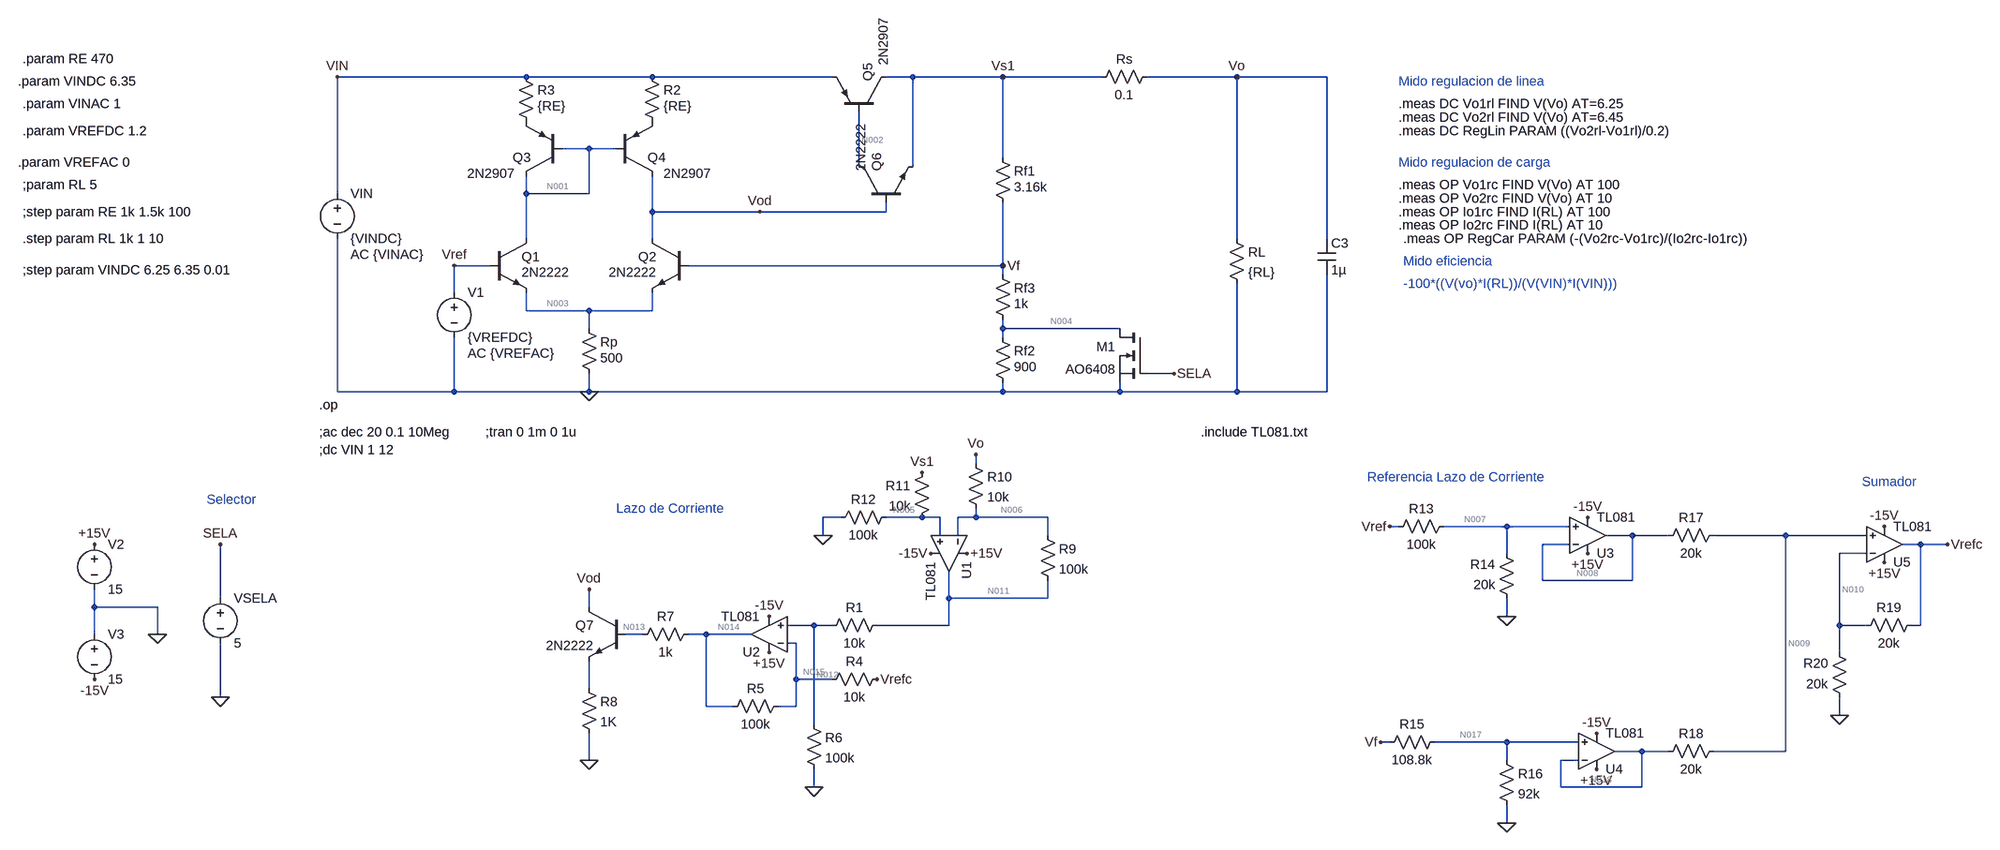
[diagram p0: schematic Regulador_LDOA_v2_Cuasi_Darlington_selector_prueba.asc]
Regulador_LDOA_v2_Cuasi_Darlington_selector_prueba.asc, the LTspice schematic file:
Version 4
SHEET 1 2316 856
WIRE -8688 -2384 -9024 -2384
WIRE -8464 -2384 -8688 -2384
WIRE -8144 -2384 -8464 -2384
WIRE -8000 -2384 -8048 -2384
WIRE -7840 -2384 -8000 -2384
WIRE -7664 -2384 -7840 -2384
WIRE -7424 -2384 -7584 -2384
WIRE -7264 -2384 -7424 -2384
WIRE -8576 -2256 -8624 -2256
WIRE -8528 -2256 -8576 -2256
WIRE -7840 -2240 -7840 -2384
WIRE -8096 -2224 -8096 -2320
WIRE -8000 -2224 -8000 -2384
WIRE -9024 -2176 -9024 -2384
WIRE -8688 -2176 -8688 -2208
WIRE -8576 -2176 -8576 -2256
WIRE -8576 -2176 -8688 -2176
WIRE -8464 -2144 -8464 -2208
WIRE -8272 -2144 -8464 -2144
WIRE -8048 -2144 -8048 -2160
WIRE -8048 -2144 -8272 -2144
WIRE -8688 -2096 -8688 -2176
WIRE -8464 -2096 -8464 -2144
WIRE -7424 -2096 -7424 -2384
WIRE -7264 -2096 -7264 -2384
WIRE -8752 -2048 -8816 -2048
WIRE -7840 -2048 -7840 -2160
WIRE -7840 -2048 -8400 -2048
WIRE -7840 -2032 -7840 -2048
WIRE -8816 -2000 -8816 -2048
WIRE -8688 -1968 -8688 -2000
WIRE -8576 -1968 -8688 -1968
WIRE -8464 -1968 -8464 -2000
WIRE -8464 -1968 -8576 -1968
WIRE -8576 -1936 -8576 -1968
WIRE -7840 -1936 -7840 -1952
WIRE -7632 -1936 -7840 -1936
WIRE -7840 -1920 -7840 -1936
WIRE -7536 -1856 -7584 -1856
WIRE -9024 -1824 -9024 -2096
WIRE -8816 -1824 -8816 -1920
WIRE -8816 -1824 -9024 -1824
WIRE -8576 -1824 -8576 -1856
WIRE -8576 -1824 -8816 -1824
WIRE -7840 -1824 -7840 -1840
WIRE -7840 -1824 -8576 -1824
WIRE -7632 -1824 -7632 -1840
WIRE -7632 -1824 -7840 -1824
WIRE -7424 -1824 -7424 -2016
WIRE -7424 -1824 -7632 -1824
WIRE -7264 -1824 -7264 -2032
WIRE -7264 -1824 -7424 -1824
WIRE -7888 -1696 -7888 -1712
WIRE -8128 -1600 -8160 -1600
WIRE -7984 -1600 -8048 -1600
WIRE -7952 -1600 -7984 -1600
WIRE -7888 -1600 -7888 -1616
WIRE -7888 -1600 -7920 -1600
WIRE -7760 -1600 -7888 -1600
WIRE -7136 -1584 -7152 -1584
WIRE -6944 -1584 -7056 -1584
WIRE -6832 -1584 -6944 -1584
WIRE -8160 -1568 -8160 -1600
WIRE -7952 -1568 -7952 -1600
WIRE -7920 -1568 -7920 -1600
WIRE -7760 -1568 -7760 -1600
WIRE -6720 -1568 -6768 -1568
WIRE -6656 -1568 -6720 -1568
WIRE -6448 -1568 -6576 -1568
WIRE -6304 -1568 -6448 -1568
WIRE -6832 -1552 -6880 -1552
WIRE -6208 -1552 -6240 -1552
WIRE -6160 -1552 -6208 -1552
WIRE -6944 -1536 -6944 -1584
WIRE -6304 -1536 -6352 -1536
WIRE -6880 -1488 -6880 -1552
WIRE -6720 -1488 -6720 -1568
WIRE -6720 -1488 -6880 -1488
WIRE -9232 -1456 -9232 -1552
WIRE -7936 -1456 -7936 -1504
WIRE -7760 -1456 -7760 -1488
WIRE -7760 -1456 -7936 -1456
WIRE -9456 -1440 -9456 -1472
WIRE -9344 -1440 -9456 -1440
WIRE -8576 -1440 -8576 -1472
WIRE -6944 -1424 -6944 -1456
WIRE -8176 -1408 -8224 -1408
WIRE -8144 -1408 -8176 -1408
WIRE -7936 -1408 -7936 -1456
WIRE -7936 -1408 -8064 -1408
WIRE -6352 -1408 -6352 -1536
WIRE -6304 -1408 -6352 -1408
WIRE -6208 -1408 -6208 -1552
WIRE -6208 -1408 -6224 -1408
WIRE -9456 -1392 -9456 -1440
WIRE -9344 -1392 -9344 -1440
WIRE -8480 -1392 -8512 -1392
WIRE -8368 -1392 -8400 -1392
WIRE -8288 -1392 -8368 -1392
WIRE -8208 -1376 -8224 -1376
WIRE -6352 -1360 -6352 -1408
WIRE -8208 -1312 -8208 -1376
WIRE -8144 -1312 -8208 -1312
WIRE -8576 -1296 -8576 -1344
WIRE -9232 -1280 -9232 -1376
WIRE -8368 -1264 -8368 -1392
WIRE -8320 -1264 -8368 -1264
WIRE -8208 -1264 -8208 -1312
WIRE -8208 -1264 -8240 -1264
WIRE -6352 -1248 -6352 -1280
WIRE -8176 -1232 -8176 -1408
WIRE -7152 -1200 -7168 -1200
WIRE -6944 -1200 -7072 -1200
WIRE -6816 -1200 -6944 -1200
WIRE -6704 -1184 -6752 -1184
WIRE -6656 -1184 -6704 -1184
WIRE -6448 -1184 -6448 -1568
WIRE -6448 -1184 -6576 -1184
WIRE -8576 -1168 -8576 -1216
WIRE -6944 -1168 -6944 -1200
WIRE -6816 -1168 -6848 -1168
WIRE -8176 -1120 -8176 -1152
WIRE -6848 -1120 -6848 -1168
WIRE -6704 -1120 -6704 -1184
WIRE -6704 -1120 -6848 -1120
WIRE -6944 -1056 -6944 -1088
FLAG -8576 -1824 0
FLAG -7424 -2384 Vo
FLAG -8816 -2048 Vref
FLAG -9024 -2384 VIN
FLAG -7840 -2048 Vf
FLAG -7840 -2384 Vs1
FLAG -8176 -1120 0
FLAG -8272 -2144 Vod
FLAG -8576 -1168 0
FLAG -8576 -1472 Vod
FLAG -8064 -1312 Vrefc
FLAG -7984 -1680 Vs1
FLAG -7888 -1712 Vo
FLAG -7968 -1536 -15V
FLAG -8256 -1424 -15V
FLAG -7904 -1536 +15V
FLAG -8256 -1360 +15V
FLAG -9344 -1392 0
FLAG -9456 -1552 +15V
FLAG -9456 -1312 -15V
FLAG -8160 -1568 0
FLAG -6352 -1248 0
FLAG -6944 -1056 0
FLAG -6944 -1424 0
FLAG -6160 -1552 Vrefc
FLAG -7168 -1200 Vf
FLAG -7152 -1584 Vref
FLAG -6800 -1536 +15V
FLAG -6272 -1520 +15V
FLAG -6784 -1152 +15V
FLAG -6800 -1600 -15V
FLAG -6784 -1216 -15V
FLAG -6272 -1584 -15V
FLAG -7536 -1856 SELA
FLAG -9232 -1552 SELA
FLAG -9232 -1280 0
DATAFLAG -7584 -2384 ""
DATAFLAG -8160 -2048 ""
SYMBOL pnp -8624 -2208 R180
WINDOW 3 84 4 Left 2
SYMATTR Value 2N2907
SYMATTR InstName Q3
SYMBOL pnp -8528 -2208 M180
WINDOW 3 84 4 Left 2
SYMATTR Value 2N2907
SYMATTR InstName Q4
SYMBOL npn -8752 -2096 R0
WINDOW 3 56 60 Left 2
SYMATTR Value 2N2222
SYMATTR InstName Q1
SYMBOL npn -8400 -2096 M0
WINDOW 3 56 60 Left 2
SYMATTR Value 2N2222
SYMATTR InstName Q2
SYMBOL res -8592 -1952 R0
WINDOW 3 36 68 Left 2
SYMATTR Value 500
SYMATTR InstName Rp
SYMBOL pnp -8048 -2320 M270
WINDOW 3 84 4 Left 2
SYMATTR Value 2N2907
SYMATTR InstName Q5
SYMBOL npn -8096 -2160 R270
WINDOW 3 56 4 Left 2
SYMATTR Value 2N2222
SYMATTR InstName Q6
SYMBOL res -7856 -2256 R0
WINDOW 3 36 68 Left 2
SYMATTR Value 3.16k
SYMATTR InstName Rf1
SYMBOL res -7856 -1936 R0
WINDOW 3 36 68 Left 2
SYMATTR Value 900
SYMATTR InstName Rf2
SYMBOL res -7440 -2112 R0
SYMATTR InstName RL
SYMATTR Value {RL}
SYMBOL voltage -8816 -2016 R0
WINDOW 123 24 124 Left 2
WINDOW 39 0 0 Left 0
SYMATTR Value2 AC {VREFAC}
SYMATTR InstName V1
SYMATTR Value {VREFDC}
SYMBOL voltage -9024 -2192 R0
WINDOW 123 24 124 Left 2
WINDOW 39 0 0 Left 0
SYMATTR Value2 AC {VINAC}
SYMATTR InstName VIN
SYMATTR Value {VINDC}
SYMBOL res -8704 -2400 R0
WINDOW 3 36 68 Left 2
SYMATTR Value {RE}
SYMATTR InstName R3
SYMBOL res -8480 -2400 R0
WINDOW 3 36 68 Left 2
SYMATTR Value {RE}
SYMATTR InstName R2
SYMBOL cap -7280 -2096 R0
SYMATTR InstName C3
SYMATTR Value 1µ
SYMBOL res -7568 -2400 R90
WINDOW 0 0 56 VBottom 2
WINDOW 3 32 56 VTop 2
SYMATTR InstName Rs
SYMATTR Value 0.1
SYMBOL OpAmps\\opamp2 -7872 -1536 R90
SYMATTR InstName U1
SYMATTR Value TL081
SYMBOL OpAmps\\opamp2 -8256 -1328 R180
SYMATTR InstName U2
SYMATTR Value TL081
SYMBOL res -8048 -1424 R90
WINDOW 0 0 56 VBottom 2
WINDOW 3 32 56 VTop 2
SYMATTR InstName R1
SYMATTR Value 10k
SYMBOL res -8048 -1328 R90
WINDOW 0 0 56 VBottom 2
WINDOW 3 32 56 VTop 2
SYMATTR InstName R4
SYMATTR Value 10k
SYMBOL res -8224 -1280 R90
WINDOW 0 0 56 VBottom 2
WINDOW 3 32 56 VTop 2
SYMATTR InstName R5
SYMATTR Value 100k
SYMBOL res -8192 -1248 R0
SYMATTR InstName R6
SYMATTR Value 100k
SYMBOL npn -8512 -1440 M0
SYMATTR InstName Q7
SYMATTR Value 2N2222
SYMBOL res -8592 -1312 R0
SYMATTR InstName R8
SYMATTR Value 1K
SYMBOL voltage -9456 -1568 R0
SYMATTR InstName V2
SYMATTR Value 15
SYMBOL voltage -9456 -1408 R0
SYMATTR InstName V3
SYMATTR Value 15
SYMBOL res -7776 -1584 R0
SYMATTR InstName R9
SYMATTR Value 100k
SYMBOL res -7904 -1712 R0
SYMATTR InstName R10
SYMATTR Value 10k
SYMBOL res -7968 -1696 M0
SYMATTR InstName R11
SYMATTR Value 10k
SYMBOL res -8032 -1616 R90
WINDOW 0 0 56 VBottom 2
WINDOW 3 32 56 VTop 2
SYMATTR InstName R12
SYMATTR Value 100k
SYMBOL res -8384 -1408 R90
WINDOW 0 0 56 VBottom 2
WINDOW 3 32 56 VTop 2
SYMATTR InstName R7
SYMATTR Value 1k
SYMBOL res -7040 -1600 R90
WINDOW 0 0 56 VBottom 2
WINDOW 3 32 56 VTop 2
SYMATTR InstName R13
SYMATTR Value 100k
SYMBOL res -6928 -1440 R180
WINDOW 0 36 76 Left 2
WINDOW 3 36 40 Left 2
SYMATTR InstName R14
SYMATTR Value 20k
SYMBOL res -7168 -1184 R270
WINDOW 0 32 56 VTop 2
WINDOW 3 0 56 VBottom 2
SYMATTR InstName R15
SYMATTR Value 108.8k
SYMBOL res -6960 -1184 R0
SYMATTR InstName R16
SYMATTR Value 92k
SYMBOL res -6560 -1584 R90
WINDOW 0 0 56 VBottom 2
WINDOW 3 32 56 VTop 2
SYMATTR InstName R17
SYMATTR Value 20k
SYMBOL res -6560 -1200 R90
WINDOW 0 0 56 VBottom 2
WINDOW 3 32 56 VTop 2
SYMATTR InstName R18
SYMATTR Value 20k
SYMBOL res -6208 -1424 R90
WINDOW 0 0 56 VBottom 2
WINDOW 3 32 56 VTop 2
SYMATTR InstName R19
SYMATTR Value 20k
SYMBOL res -6336 -1264 R180
WINDOW 0 36 76 Left 2
WINDOW 3 36 40 Left 2
SYMATTR InstName R20
SYMATTR Value 20k
SYMBOL OpAmps\\opamp2 -6800 -1504 M180
SYMATTR InstName U3
SYMATTR Value TL081
SYMBOL OpAmps\\opamp2 -6784 -1120 M180
SYMATTR InstName U4
SYMATTR Value TL081
SYMBOL OpAmps\\opamp2 -6272 -1488 M180
SYMATTR InstName U5
SYMATTR Value TL081
SYMBOL res -7856 -2048 R0
WINDOW 3 36 68 Left 2
SYMATTR Value 1k
SYMATTR InstName Rf3
SYMBOL nmos -7584 -1936 M0
SYMATTR InstName M1
SYMATTR Value AO6408
SYMBOL voltage -9232 -1472 R0
WINDOW 123 0 0 Left 0
WINDOW 39 0 0 Left 0
SYMATTR InstName VSELA
SYMATTR Value 5
TEXT -9056 -1800 Left 2 !.op
TEXT -9056 -1752 Left 2 !;ac dec 20 0.1 10Meg
TEXT -9592 -2376 Left 2 !.param VINDC 6.35
TEXT -9584 -2336 Left 2 !.param VINAC 1
TEXT -9584 -2288 Left 2 !.param VREFDC 1.2
TEXT -9592 -2232 Left 2 !.param VREFAC 0
TEXT -9584 -2192 Left 2 !;param RL 5
TEXT -9056 -1720 Left 2 !;dc VIN 1 12
TEXT -9584 -2144 Left 2 !;step param RE 1k 1.5k 100
TEXT -9584 -2416 Left 2 !.param RE 470
TEXT -9584 -2096 Left 2 !.step param RL 1k 1 10
TEXT -7136 -2376 Left 2 ;Mido regulacion de linea
TEXT -7136 -2336 Left 2 !.meas DC Vo1rl FIND V(Vo) AT=6.25
TEXT -7136 -2312 Left 2 !.meas DC Vo2rl FIND V(Vo) AT=6.45
TEXT -7136 -2288 Left 2 !.meas DC RegLin PARAM ((Vo2rl-Vo1rl)/0.2)
TEXT -7136 -2232 Left 2 ;Mido regulacion de carga
TEXT -7136 -2192 Left 2 !.meas OP Vo1rc FIND V(Vo) AT 100
TEXT -7136 -2168 Left 2 !.meas OP Vo2rc FIND V(Vo) AT 10
TEXT -7136 -2144 Left 2 !.meas OP Io1rc FIND I(RL) AT 100
TEXT -7136 -2120 Left 2 !.meas OP Io2rc FIND I(RL) AT 10
TEXT -7128 -2056 Left 2 ;Mido eficiencia
TEXT -7128 -2016 Left 2 ;-100*((V(vo)*I(RL))/(V(VIN)*I(VIN)))
TEXT -7128 -2096 Left 2 !.meas OP RegCar PARAM (-(Vo2rc-Vo1rc)/(Io2rc-Io1rc))
TEXT -8760 -1752 Left 2 !;tran 0 1m 0 1u
TEXT -8528 -1616 Left 2 ;Lazo de Corriente
TEXT -7488 -1752 Left 2 !.include TL081.txt
TEXT -7192 -1672 Left 2 ;Referencia Lazo de Corriente
TEXT -9584 -2040 Left 2 !;step param VINDC 6.25 6.35 0.01
TEXT -6312 -1664 Left 2 ;Sumador
TEXT -9256 -1632 Left 2 ;Selector

The netlist it stands for:
* Regulador_LDOA_v2_Cuasi_Darlington_selector_prueba.asc
Q3 N001 N001 P001 0 2N2907
Q4 Vod N001 P002 0 2N2907
Q1 N001 Vref N003 0 2N2222
Q2 Vod Vf N003 0 2N2222
Rp N003 0 500
Q5 Vs1 N002 VIN 0 2N2907
Q6 N002 Vod Vs1 0 2N2222
Rf1 Vs1 Vf 3.16k
Rf2 N004 0 900
RL Vo 0 {RL}
V1 Vref 0 {VREFDC} AC {VREFAC}
VIN VIN 0 {VINDC} AC {VINAC}
R3 VIN P001 {RE}
R2 VIN P002 {RE}
C3 Vo 0 1µ
Rs Vo Vs1 0.1
XU1 N005 N006 +15V -15V N011 TL081  ; pins In+ In- V+ V- OUT
XU2 N012 N015 +15V -15V N014 TL081  ; pins In+ In- V+ V- OUT
R1 N011 N012 10k
R4 Vrefc N015 10k
R5 N015 N014 100k
R6 N012 0 100k
Q7 Vod N013 N016 0 2N2222
R8 N016 0 1K
V2 +15V 0 15
V3 0 -15V 15
R9 N006 N011 100k
R10 Vo N006 10k
R11 Vs1 N005 10k
R12 N005 0 100k
R7 N014 N013 1k
R13 N007 Vref 100k
R14 0 N007 20k
R15 Vf N017 108.8k
R16 N017 0 92k
R17 N009 N008 20k
R18 N009 N018 20k
R19 Vrefc N010 20k
R20 0 N010 20k
XU3 N007 N008 +15V -15V N008 TL081  ; pins In+ In- V+ V- OUT
XU4 N017 N018 +15V -15V N018 TL081  ; pins In+ In- V+ V- OUT
XU5 N009 N010 +15V -15V Vrefc TL081  ; pins In+ In- V+ V- OUT
Rf3 Vf N004 1k
M1 N004 SELA 0 0 AO6408
VSELA SELA 0 5
.model NPN NPN
.model PNP PNP
.lib standard.bjt
.model NMOS NMOS
.model PMOS PMOS
.lib standard.mos
.op
;ac dec 20 0.1 10Meg
.param VINDC 6.35
.param VINAC 1
.param VREFDC 1.2
.param VREFAC 0
;param RL 5
;dc VIN 1 12
;step param RE 1k 1.5k 100
.param RE 470
.step param RL 1k 1 10
* Mido regulacion de linea
.meas DC Vo1rl FIND V(Vo) AT=6.25
.meas DC Vo2rl FIND V(Vo) AT=6.45
.meas DC RegLin PARAM ((Vo2rl-Vo1rl)/0.2)
* Mido regulacion de carga
.meas OP Vo1rc FIND V(Vo) AT 100
.meas OP Vo2rc FIND V(Vo) AT 10
.meas OP Io1rc FIND I(RL) AT 100
.meas OP Io2rc FIND I(RL) AT 10
* Mido eficiencia
* -100*((V(vo)*I(RL))/(V(VIN)*I(VIN)))
.meas OP RegCar PARAM (-(Vo2rc-Vo1rc)/(Io2rc-Io1rc))
;tran 0 1m 0 1u
* Lazo de Corriente
.include TL081.txt
* Referencia Lazo de Corriente
;step param VINDC 6.25 6.35 0.01
* Sumador
* Selector
.backanno
.end

* Results of the author's LTspice run, read from the files saved beside the schematic
* Operating Point, zero values left out:
*   V(n001) = 5.448 V
*   V(p001) = 6.088 V
*   V(vod) = 5.578 V
*   V(p002) = 6.088 V
*   V(vref) = 1.2 V
*   V(n003) = 560.8 mV
*   V(vf) = 1.2 V
*   V(vs1) = 5.018 V
*   V(n002) = 5.645 V
*   V(vin) = 6.35 V
*   V(n004) = 13.41 µV
*   V(vo) = 5.018 V
*   V(n011) = 3.791 mV
*   V(-15v) = -15 V
*   V(+15v) = 15 V
*   V(n006) = 4.562 V
*   V(n005) = 4.562 V
*   V(n014) = -7.458 V
*   V(n015) = 3.489 mV
*   V(n012) = 3.446 mV
*   V(vrefc) = 749.7 mV
*   V(n013) = -7.458 V
*   V(n007) = 200 mV
*   V(n017) = 549.7 mV
*   V(n009) = 374.8 mV
*   V(n008) = 200 mV
*   V(n018) = 549.7 mV
*   V(n010) = 374.8 mV
*   V(sela) = 5 V
*   Ic(Q7) = 13.04 pA
*   Ib(Q7) = -20.5 pA
*   Ie(Q7) = 7.458 pA
*   Ic(Q6) = 25.56 µA
*   Ib(Q6) = 127.7 nA
*   Ie(Q6) = -25.69 µA
*   Ic(Q2) = 555.7 µA
*   Ib(Q2) = 2.667 µA
*   Ie(Q2) = -558.4 µA
*   Ic(Q1) = 560.4 µA
*   Ib(Q1) = 2.693 µA
*   Ie(Q1) = -563.1 µA
*   Ic(Q5) = -6.292 mA
*   Ib(Q5) = -25.56 µA
*   Ie(Q5) = 6.317 mA
*   Ic(Q4) = -555.9 µA
*   Ib(Q4) = -2.23 µA
*   Ie(Q4) = 558.1 µA
*   Ic(Q3) = -555.9 µA
*   Ib(Q3) = -2.228 µA
*   Ie(Q3) = 558.2 µA
*   Id(M1) = 1.2 mA
*   Is(M1) = -1.2 mA
*   I(Rf3) = 1.2 mA
*   I(R20) = -18.74 µA
*   I(R19) = 18.74 µA
*   I(R18) = -8.742 µA
*   I(R17) = 8.742 µA
*   I(R16) = 5.975 µA
*   I(R15) = 5.975 µA
*   I(R14) = -10 µA
*   I(R13) = -10 µA
*   I(R7) = -20.5 pA
*   I(R12) = 45.62 µA
*   I(R11) = 45.62 µA
*   I(R10) = 45.58 µA
*   I(R9) = 45.58 µA
*   I(R8) = -7.458 pA
*   I(R6) = 34.46 nA
*   I(R5) = 74.62 µA
*   I(R4) = 74.62 µA
*   I(R1) = 34.5 nA
*   I(Rs) = -5.063 mA
*   I(R2) = 558.1 µA
*   I(R3) = 558.2 µA
*   I(Rl) = 5.018 mA
*   I(Rf2) = 14.9 nA
*   I(Rf1) = 1.208 mA
*   I(Rp) = 1.122 mA
*   I(V3) = -70.97 mA
*   I(V2) = -70.97 mA
*   I(Vin) = -7.433 mA
*   I(V1) = -12.69 µA
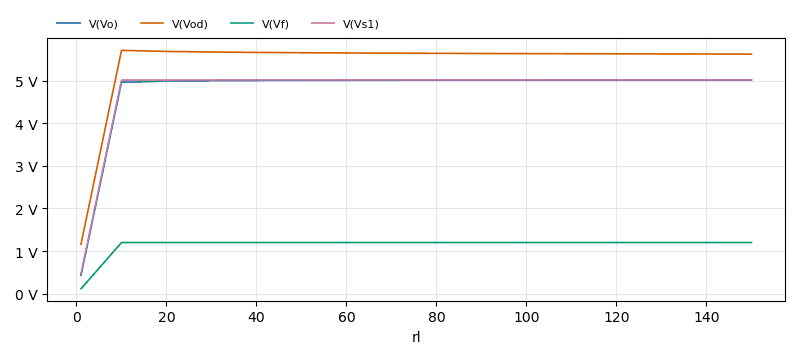
[diagram p1: Operating Point of Regulador_LDOA_v2_Cuasi_Darlington_selector_prueba.asc, plotted from the saved traces]
* Operating Point, 1 run:
*   V(Vo): 427.5 mV at rl=1 , 5.015 V at rl=150 , min 427.5 mV, max 5.015 V
*   V(Vod): 1.16 V at rl=1 , 5.625 V at rl=150 , min 1.16 V, max 5.712 V
*   V(Vf): 112.6 mV at rl=1 , 1.2 V at rl=150 , min 112.6 mV, max 1.2 V
*   V(Vs1): 470.3 mV at rl=1 , 5.018 V at rl=150 , min 470.3 mV, max 5.018 V
* From the log:
*   Semiconductor Device Operating Points:
*                           --- Diodes ---
*   Name:    d:u5:p      d:u5:ln     d:u5:lp     d:u5:e      d:u5:c
*   Model:    u5:dx       u5:dx       u5:dx       u5:dx       u5:dx
*   Id:     -3.00e-11   -2.50e-11   -2.50e-11   -1.31e-11   -1.25e-11
*   Vd:     -3.00e+01   -2.50e+01   -2.50e+01   -1.31e+01   -1.25e+01
*   Req:     1.00e+12    1.00e+12    1.00e+12    1.00e+12    1.00e+12
*   CAP:     0.00e+00    0.00e+00    0.00e+00    0.00e+00    0.00e+00
*   Name:    d:u4:p      d:u4:ln     d:u4:lp     d:u4:e      d:u4:c
*   Model:    u4:dx       u4:dx       u4:dx       u4:dx       u4:dx
*   Id:     -3.00e-11   -2.50e-11   -2.50e-11   -1.29e-11   -1.27e-11
*   Vd:     -3.00e+01   -2.50e+01   -2.50e+01   -1.29e+01   -1.27e+01
*   Req:     1.00e+12    1.00e+12    1.00e+12    1.00e+12    1.00e+12
*   CAP:     0.00e+00    0.00e+00    0.00e+00    0.00e+00    0.00e+00
*   Name:    d:u3:p      d:u3:ln     d:u3:lp     d:u3:e      d:u3:c
*   Model:    u3:dx       u3:dx       u3:dx       u3:dx       u3:dx
*   Id:     -3.00e-11   -2.50e-11   -2.50e-11   -1.30e-11   -1.26e-11
*   Vd:     -3.00e+01   -2.50e+01   -2.50e+01   -1.30e+01   -1.26e+01
*   Req:     1.00e+12    1.00e+12    1.00e+12    1.00e+12    1.00e+12
*   CAP:     0.00e+00    0.00e+00    0.00e+00    0.00e+00    0.00e+00
*   Name:    d:u2:p      d:u2:ln     d:u2:lp     d:u2:e      d:u2:c
*   Model:    u2:dx       u2:dx       u2:dx       u2:dx       u2:dx
*   Id:     -3.00e-11   -2.50e-11   -2.50e-11   -1.46e-11   -1.10e-11
*   Vd:     -3.00e+01   -2.50e+01   -2.50e+01   -1.46e+01   -1.10e+01
*   Req:     1.00e+12    1.00e+12    1.00e+12    1.00e+12    1.00e+12
*   CAP:     0.00e+00    0.00e+00    0.00e+00    0.00e+00    0.00e+00
*   Name:    d:u1:p      d:u1:ln     d:u1:lp     d:u1:e      d:u1:c
*   Model:    u1:dx       u1:dx       u1:dx       u1:dx       u1:dx
*   Id:     -3.00e-11   -2.50e-11   -2.50e-11   -1.32e-11   -1.24e-11
*   Vd:     -3.00e+01   -2.50e+01   -2.50e+01   -1.32e+01   -1.24e+01
*   Req:     1.00e+12    1.00e+12    1.00e+12    1.00e+12    1.00e+12
*   CAP:     0.00e+00    0.00e+00    0.00e+00    0.00e+00    0.00e+00
*                           --- Bipolar Transistors ---
*   Name:       q7          q6          q2          q1          q5
*   Model:    2n2222      2n2222      2n2222      2n2222      2n2907
*   Ib:       2.17e-05    1.87e-05   -1.48e-12    5.22e-06   -3.84e-03
*   Ic:       1.06e-03    3.84e-03    1.05e-12    1.08e-03   -4.24e-01
*   Vbe:      6.59e-01    6.90e-01   -4.31e-01    6.57e-01   -9.57e-01
*   Vbc:      5.76e-01   -4.23e+00   -1.05e+00   -3.99e+00    4.92e+00
*   Vce:      8.22e-02    4.92e+00    6.17e-01    4.64e+00   -5.88e+00
*   BetaDC:   4.88e+01    2.06e+02   -7.10e-01    2.07e+02    1.10e+02
*   Gm:       4.13e-02    1.47e-01    2.27e-20    4.17e-02    1.04e+01
*   Rpi:      4.57e+03    1.39e+03    1.00e+12    4.96e+03    6.73e+00
*   Rx:       1.00e+01    1.00e+01    1.00e+01    1.00e+01    1.00e+01
*   Ro:       5.41e+02    2.71e+04    1.72e+23    9.61e+04    2.95e+02
*   Cbe:      5.65e-11    9.88e-11    2.15e-11    5.59e-11    5.67e-09
*   Cbc:      1.98e-10    4.28e-12    6.00e-12    4.35e-12    4.12e-12
*   Cjs:      0.00e+00    0.00e+00    0.00e+00    0.00e+00    0.00e+00
*   BetaAC:   1.89e+02    2.03e+02    2.27e-08    2.06e+02    7.00e+01
*   Cbx:      0.00e+00    0.00e+00    0.00e+00    0.00e+00    0.00e+00
*   Ft:       2.59e+07    2.26e+08    5.78e-03    1.10e+08    2.92e+08
*   Name:       q4          q3
*   Model:    2n2907      2n2907
*   Ib:      -4.18e-06   -4.31e-06
*   Ic:      -1.08e-03   -1.07e-03
*   Vbe:     -6.56e-01   -6.57e-01
*   Vbc:      4.03e+00    0.00e+00
*   Vce:     -4.68e+00   -6.57e-01
*   BetaDC:   2.57e+02    2.49e+02
*   Gm:       4.14e-02    4.13e-02
*   Rpi:      6.19e+03    6.00e+03
*   Rx:       1.00e+01    1.00e+01
*   Ro:       1.15e+05    1.12e+05
*   Cbe:      6.36e-11    6.36e-11
*   Cbc:      4.34e-12    8.00e-12
*   Cjs:      0.00e+00    0.00e+00
*   BetaAC:   2.57e+02    2.48e+02
*   Cbx:      0.00e+00    0.00e+00
*   Ft:       9.70e+07    9.19e+07
*                           --- JFET Transistors ---
*   Name:    j:u5:2      j:u5:1      j:u4:2      j:u4:1      j:u3:2
*   Model:    u5:jx       u5:jx       u4:jx       u4:jx       u3:jx
*   Id:     -9.76e-05   -9.76e-05   -9.77e-05   -9.77e-05   -9.76e-05
*   Vgs:     3.99e-01    3.99e-01    3.99e-01    3.99e-01    3.99e-01
*   Vds:    -1.44e+01   -1.44e+01   -1.43e+01   -1.43e+01   -1.45e+01
*   Gm:      3.25e-04    3.25e-04    3.25e-04    3.25e-04    3.25e-04
*   Gds:     0.00e+00    0.00e+00    0.00e+00    0.00e+00    0.00e+00
*   Cgs:     0.00e+00    0.00e+00    0.00e+00    0.00e+00    0.00e+00
*   Cgd:     0.00e+00    0.00e+00    0.00e+00    0.00e+00    0.00e+00
*   Name:    j:u3:1      j:u2:2      j:u2:1      j:u1:2      j:u1:1
*   Model:    u3:jx       u2:jx       u2:jx       u1:jx       u1:jx
*   Id:     -9.76e-05   -9.75e-05   -9.75e-05   -9.75e-05   -9.75e-05
*   Vgs:     3.99e-01    3.99e-01    3.99e-01    3.99e-01    3.99e-01
*   Vds:    -1.45e+01   -1.46e+01   -1.46e+01   -1.47e+01   -1.47e+01
*   Gm:      3.25e-04    3.25e-04    3.25e-04    3.25e-04    3.25e-04
*   Gds:     0.00e+00    0.00e+00    0.00e+00    0.00e+00    0.00e+00
*   Cgs:     0.00e+00    0.00e+00    0.00e+00    0.00e+00    0.00e+00
*   Cgd:     0.00e+00    0.00e+00    0.00e+00    0.00e+00    0.00e+00
*                           --- VDMOSFET Transistors ---
*   Name:          m1
*   Model:       ao6408
*   Id:          1.13e-04
*   Vgs:         5.00e+00
*   Vds:         1.26e-06
*   Vth:         1.00e+00
*   Gm:          2.82e-05
*   Gds:         3.60e+02
*   Cgs:         1.00e-09
*   Cgd:         7.00e-10
*   Cbody:       3.60e-10